# Altium schematic sheet uc.SchDoc
size A3
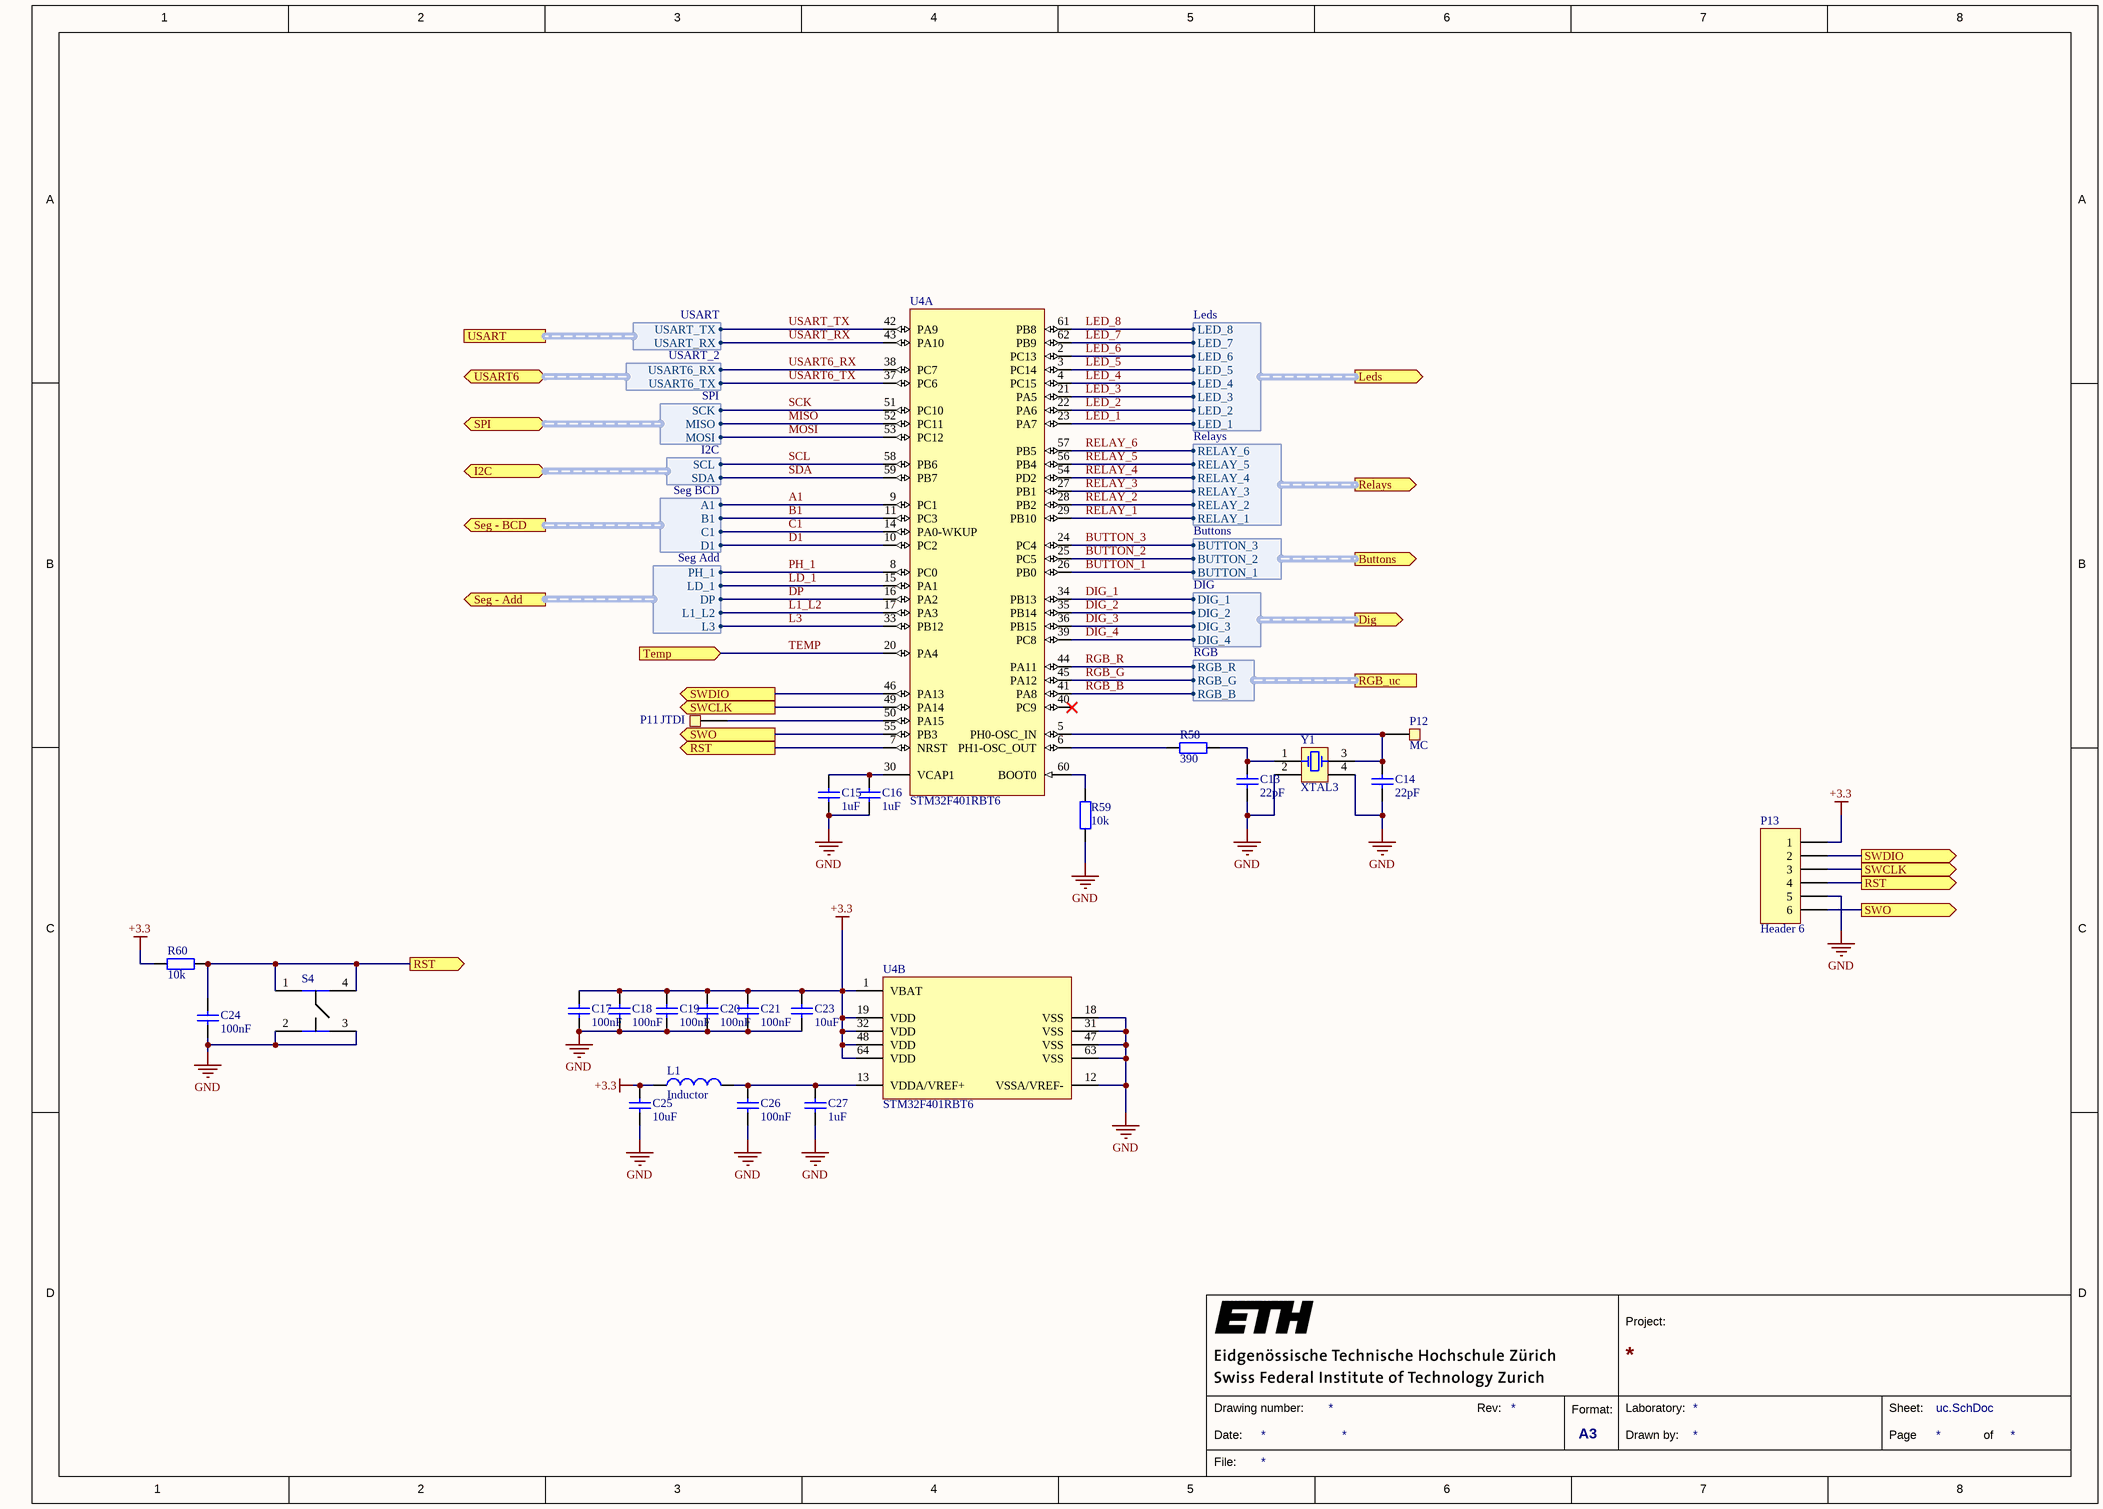
[diagram p0: uc.SchDoc]

## Parts
C13  22pF  [CAP_0603i_1608m -N]
C14  22pF  [CAP_0603i_1608m -N]
C15  1uF  [CAP_0603i_1608m -N]
C16  1uF  [CAP_0603i_1608m -N]
C17  100nF  [CAP_0603i_1608m -N]
C18  100nF  [CAP_0603i_1608m -N]
C19  100nF  [CAP_0603i_1608m -N]
C20  100nF  [CAP_0603i_1608m -N]
C21  100nF  [CAP_0603i_1608m -N]
C23  10uF  [CAP_0805i_2012m -N]
C24  100nF  [CAP_0603i_1608m -N]
C25  10uF  [CAP_0805i_2012m -N]
C26  100nF  [CAP_0603i_1608m -N]
C27  1uF  [CAP_0603i_1608m -N]
L1  Inductor  [IND_0603i_1608m -L]
P11  JTDI  [Pad_0603]
P12  MC  [Pad_3x3mm]
P13  Header 6  [HDR1X6]
R58  390  [RES_0805i_2012m -N]
R59  10k  [RES_0603i_1608m -N]
R60  10k  [RES_0603i_1608m -N]
S4  EVQ-Q2U02W  [EVQQ2]  (value not drawn)
U4  STM32F401RBT6  [STM-LQFP64_L]  (parts A,B of 2)
Y1  XTAL3  [TSX-3225 2*2.5]

## Ports
Buttons (out, harness Buttons), Dig (out, harness DIG), I2C (bidir, harness I2C), Leds (out, harness Leds), Relays (out, harness Relays), RGB_uc (harness RGB), RST (out), Seg - Add (out, harness Seg Add), Seg - BCD (out, harness Seg BCD), SPI (bidir, harness SPI), SWCLK (out), SWDIO (out), SWO (out), Temp (in), USART6 (bidir, harness USART_2), USART (harness USART)

## Harnesses
USART: USART_RX, USART_TX
USART_2: USART6_TX, USART6_RX
SPI: MOSI, MISO, SCK
I2C: SDA, SCL
Seg BCD: D1, C1, B1, A1
Seg Add: L3, L1_L2, DP, LD_1, PH_1
Leds: LED_1, LED_2, LED_3, LED_4, LED_5, LED_6, LED_7, LED_8
Relays: RELAY_1, RELAY_2, RELAY_3, RELAY_4, RELAY_5, RELAY_6
Buttons: BUTTON_3, BUTTON_2, BUTTON_1
DIG: DIG_4, DIG_3, DIG_2, DIG_1
RGB: RGB_R, RGB_G, RGB_B

## Nets
+3.3: C17.1 C18.2 C19.2 C20.1 C21.2 C23.2 C25.2 L1.2 P13.1 R60.1 U4.1(VBAT) U4.19(VDD) U4.32(VDD) U4.48(VDD) U4.64(VDD)
GND: C13.1 C14.1 C15.1 C16.1 C17.2 C18.1 C19.1 C20.2 C21.1 C23.1 C24.1 C25.1 C26.1 C27.1 P13.5 R59.1 S4.2(COM_1) S4.3(COM_2) U4.12(VSSA/VREF-) U4.18(VSS) U4.31(VSS) U4.47(VSS) U4.63(VSS) Y1.2(COM) Y1.4(COM)
A1: U4.9(PC1) ; port Seg - BCD.A1
B1: U4.11(PC3) ; port Seg - BCD.B1
BUTTON_1: U4.26(PB0) ; port Buttons.BUTTON_1
BUTTON_2: U4.25(PC5) ; port Buttons.BUTTON_2
BUTTON_3: U4.24(PC4) ; port Buttons.BUTTON_3
C1: U4.14(PA0-WKUP) ; port Seg - BCD.C1
D1: U4.10(PC2) ; port Seg - BCD.D1
DIG_1: U4.34(PB13) ; port Dig.DIG_1
DIG_2: U4.35(PB14) ; port Dig.DIG_2
DIG_3: U4.36(PB15) ; port Dig.DIG_3
DIG_4: U4.39(PC8) ; port Dig.DIG_4
DP: U4.16(PA2) ; port Seg - Add.DP
L1_L2: U4.17(PA3) ; port Seg - Add.L1_L2
L3: U4.33(PB12) ; port Seg - Add.L3
LD_1: U4.15(PA1) ; port Seg - Add.LD_1
LED_1: U4.23(PA7) ; port Leds.LED_1
LED_2: U4.22(PA6) ; port Leds.LED_2
LED_3: U4.21(PA5) ; port Leds.LED_3
LED_4: U4.4(PC15) ; port Leds.LED_4
LED_5: U4.3(PC14) ; port Leds.LED_5
LED_6: U4.2(PC13) ; port Leds.LED_6
LED_7: U4.62(PB9) ; port Leds.LED_7
LED_8: U4.61(PB8) ; port Leds.LED_8
MISO: U4.52(PC11) ; port SPI.MISO
MOSI: U4.53(PC12) ; port SPI.MOSI
PH_1: U4.8(PC0) ; port Seg - Add.PH_1
RELAY_1: U4.29(PB10) ; port Relays.RELAY_1
RELAY_2: U4.28(PB2) ; port Relays.RELAY_2
RELAY_3: U4.27(PB1) ; port Relays.RELAY_3
RELAY_4: U4.54(PD2) ; port Relays.RELAY_4
RELAY_5: U4.56(PB4) ; port Relays.RELAY_5
RELAY_6: U4.57(PB5) ; port Relays.RELAY_6
RGB_B: U4.41(PA8) ; port RGB_uc.RGB_B
RGB_G: U4.45(PA12) ; port RGB_uc.RGB_G
RGB_R: U4.44(PA11) ; port RGB_uc.RGB_R
RST: C24.2 P13.4 R60.2 S4.1(NO_1) S4.4(NO_2) U4.7(NRST) ; port RST
SCK: U4.51(PC10) ; port SPI.SCK
SCL: U4.58(PB6) ; port I2C.SCL
SDA: U4.59(PB7) ; port I2C.SDA
SWCLK: P13.3 U4.49(PA14) ; port SWCLK
SWDIO: P13.2 U4.46(PA13) ; port SWDIO
SWO: P13.6 U4.55(PB3) ; port SWO
TEMP: U4.20(PA4) ; port Temp
USART6_RX: U4.38(PC7) ; port USART6.USART6_RX
USART6_TX: U4.37(PC6) ; port USART6.USART6_TX
USART_RX: U4.43(PA10) ; port USART.USART_RX
USART_TX: U4.42(PA9) ; port USART.USART_TX
NetC13_2: C13.2 R58.2 Y1.1(OSC1)
NetC14_2: C14.2 P12.1 U4.5(PH0-OSC_IN) Y1.3(OSC2)
NetC15_2: C15.2 C16.2 U4.30(VCAP1)
NetC26_2: C26.2 C27.2 L1.1 U4.13(VDDA/VREF+)
NetP11_1: P11.1 U4.50(PA15)
NetR58_1: R58.1 U4.6(PH1-OSC_OUT)
NetR59_2: R59.2 U4.60(BOOT0)

Not connected (* = marked no-connect by the designer): U4 40(PC9)*

## Notes on the sheet
- 1
- 2
- 3
- 4
- 5
- 6
- 7
- 8
- A
- B
- C
- D
- Project:
- Date:
- Drawing number:
- Rev:
- Format:
- A3
- Drawn by:
- Laboratory:
- Page
- Sheet:
- of
- File:

## Library data of the parts
C13-C21 C23-C27 = Cap: capacitor
P11 P12 = Pad: Single Pad or Testpoint
P13 = Header 6: Header, 6-Pin
R58-R60 = Res: Resistor
S4 = EVQ-Q2U02W: White Button Tactile Switch, Single Pole Single Throw (SPST) 20 mA @ 15 V dc 0.7mm; Manufacturer_Name: Panasonic; Mouser Part Number: 667-EVQ-Q2U02W; Mouser Price/Stock: https://www.mouser.com/Search/Refine.aspx?Keyword=667-EVQ-Q2U02W; Manufacturer_Part_Number: EVQ-Q2U02W; Datasheet Link: https://componentsearchengine.com/Datasheets/1/EVQ-Q2U02W.pdf
U4 = CMP-0243-00094-2: ARM Cortex-M4 32-bit MCU+FPU, 105 DMIPS, 128 kB Flash, 64 kB Internal RAM, 48 I/Os, 64-pin LQFP, -40 to 85 degC, Tray; Manufacturer: STMicroelectronics; Internal RAM Size (kB): 64; FLASH Size (Prog) (kB): 128; Supply Voltage(Vcc) max (V): 3.6; I/Os (High Current): 48; Supply Voltage(Vcc) min (V): 1.8; Operating Frequency(F) (Processor speed) (MHz): 84; Core: ARM Cortex-M4; PackageDescription: 64-Pin Low Profile Quad Flat Package, 10 x 10 mm Body, 0.5 mm Pitch; Mounting Technology: Surface Mount; PackageVersion: Rev. 4, 06/2013; ComponentLink1URL: http://www.st.com/web/en/home.html; ComponentLink3Description: Package Specification; ComponentLink2Description: Datasheet; ComponentLink3URL: http://www.st.com/st-web-ui/static/active/en/resource/technical/document/datasheet/DM00037051.pdf; ComponentLink2URL: http://www.st.com/st-web-ui/static/active/en/resource/technical/document/data_brief/DM00071938.pdf; DatasheetVersion: Rev. 1; Packing: Tray; PackageReference: LQFP64; PartNumber: STM32F401RBT6; ComponentLink1Description: Manufacturer URL
Y1 = XTAL3: Industrial Ceramic Resonator